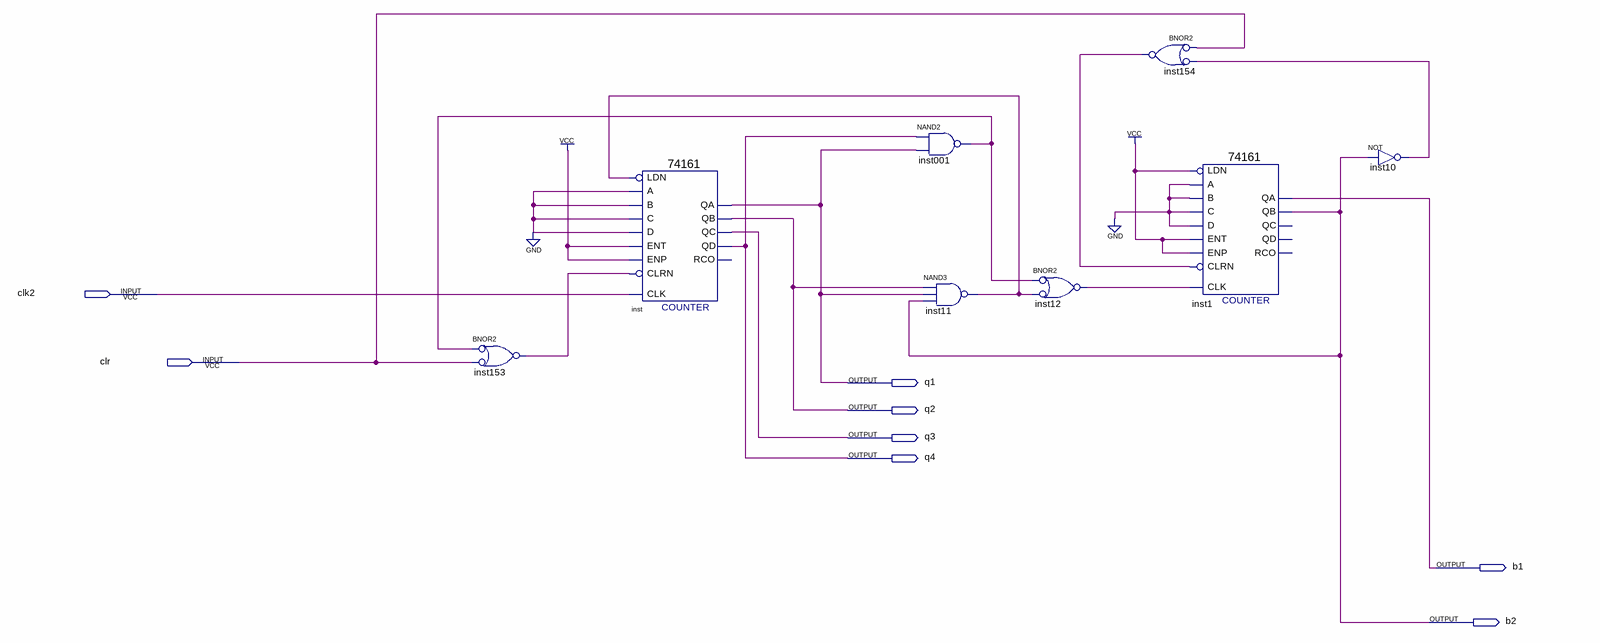
[diagram p0: schematic sheet]
// Quartus schematic count24.bdf as structural Verilog: 8 symbols, 8 pins
module count24 (
  input  clk2,
  input  clr,
  output q1,
  output q2,
  output q3,
  output q4,
  output b1,
  output b2
);

  wire inst001_out, inst10_out, inst11_out, inst12_out, inst153_out, inst154_out;

  nor inst153 (inst153_out, ~inst001_out, ~clr);  // BNOR2
  \74161  inst (
    .CLRN(inst153_out), .CLK(clk2), .ENP(1'b1), .LDN(inst11_out), .A(1'b0), .D(1'b0), .ENT(1'b1), .B(1'b0),
    .C(1'b0), .QD(q4), .QC(q3), .QB(q2), .QA(q1));  // open: RCO
  nand inst001 (inst001_out, q4, q1);
  nand inst11 (inst11_out, q2, q1, b2);
  nor inst12 (inst12_out, ~inst001_out, ~inst11_out);  // BNOR2
  nor inst154 (inst154_out, ~clr, ~inst10_out);  // BNOR2
  \74161  inst1 (
    .CLRN(inst154_out), .CLK(inst12_out), .ENP(1'b1), .LDN(1'b1), .A(1'b0), .D(1'b0), .ENT(1'b1), .B(1'b0),
    .C(1'b0), .QB(b2), .QA(b1));  // open: QD, QC, RCO
  not inst10 (inst10_out, b2);
endmodule
